# Altium schematic sheet Digital Isolation.SchDoc
size A3; SheetNumber: 7; SheetTotal: 9
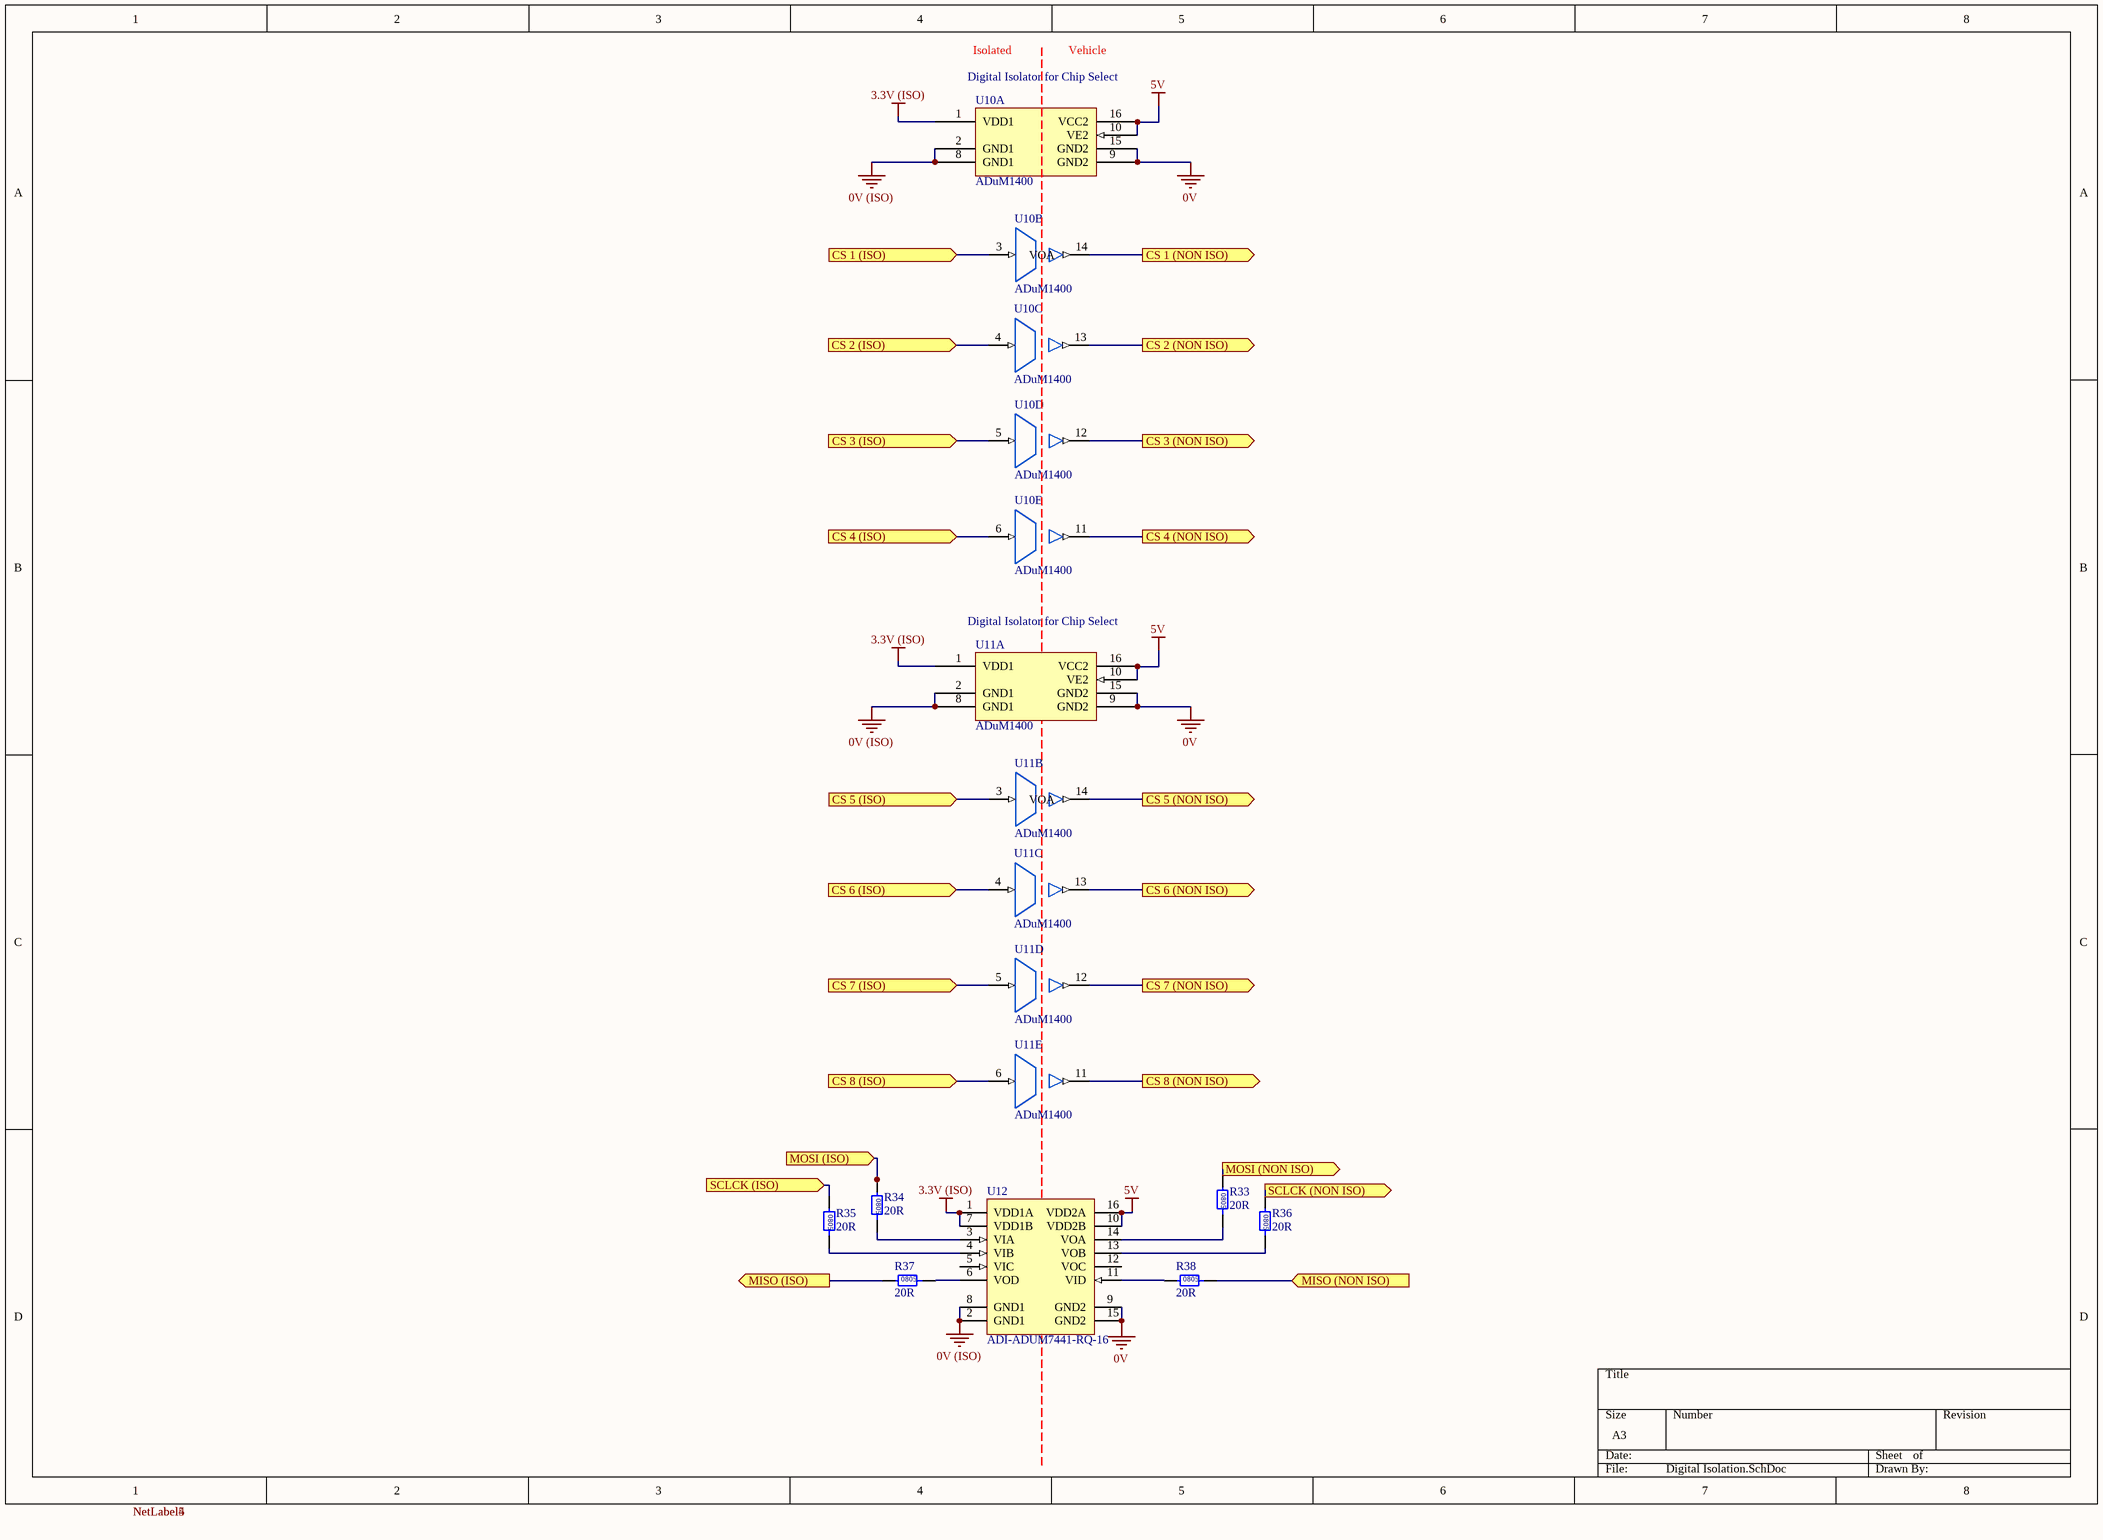
[diagram p0: Digital Isolation.SchDoc]

## Parts
R33  20R  [0805]
R34  20R  [0805]
R35  20R  [0805]
R36  20R  [0805]
R37  20R  [0805]
R38  20R  [0805]
U10  ADuM1400  [AD 16-SOIC]  (parts A,B,C,D,E of 5)
U11  ADuM1400  [AD 16-SOIC]  (parts A,B,C,D,E of 5)
U12  ADI-ADUM7441-RQ-16  [ADI-RQ-16_M]

## Ports
CS 1 (ISO) (in), CS 1 (NON ISO) (out), CS 2 (ISO) (in), CS 2 (NON ISO) (out), CS 3 (ISO) (in), CS 3 (NON ISO) (out), CS 4 (ISO) (in), CS 4 (NON ISO) (out), CS 5 (ISO) (in), CS 5 (NON ISO) (out), CS 6 (ISO) (in), CS 6 (NON ISO) (out), CS 7 (ISO) (in), CS 7 (NON ISO) (out), CS 8 (ISO) (in), CS 8 (NON ISO) (out), MISO (ISO) (out), MISO (NON ISO) (in), MOSI (ISO) (in), MOSI (NON ISO) (out), SCLCK (ISO) (in), SCLCK (NON ISO) (out)

## Nets
0V: U10.9(GND2) U10.15(GND2) U11.9(GND2) U11.15(GND2) U12.9(GND2) U12.15(GND2)
0V (ISO): U10.2(GND1) U10.8(GND1) U11.2(GND1) U11.8(GND1) U12.2(GND1) U12.8(GND1)
3.3V (ISO): U10.1(VDD1) U11.1(VDD1) U12.1(VDD1A) U12.7(VDD1B)
5V: U10.10(VE2) U10.16(VCC2) U11.10(VE2) U11.16(VCC2) U12.10(VDD2B) U12.16(VDD2A)
CS 1 (ISO): U10.3(VIA) ; port CS 1 (ISO)
CS 1 (NON ISO): U10.14(VOA) ; port CS 1 (NON ISO)
CS 2 (ISO): U10.4(VIB) ; port CS 2 (ISO)
CS 2 (NON ISO): U10.13(VOB) ; port CS 2 (NON ISO)
CS 3 (ISO): U10.5(VIC) ; port CS 3 (ISO)
CS 3 (NON ISO): U10.12(VOC) ; port CS 3 (NON ISO)
CS 4 (ISO): U10.6(VID) ; port CS 4 (ISO)
CS 4 (NON ISO): U10.11(VOD) ; port CS 4 (NON ISO)
CS 5 (ISO): U11.3(VIA) ; port CS 5 (ISO)
CS 5 (NON ISO): U11.14(VOA) ; port CS 5 (NON ISO)
CS 6 (ISO): U11.4(VIB) ; port CS 6 (ISO)
CS 6 (NON ISO): U11.13(VOB) ; port CS 6 (NON ISO)
CS 7 (ISO): U11.5(VIC) ; port CS 7 (ISO)
CS 7 (NON ISO): U11.12(VOC) ; port CS 7 (NON ISO)
CS 8 (ISO): U11.6(VID) ; port CS 8 (ISO)
CS 8 (NON ISO): U11.11(VOD) ; port CS 8 (NON ISO)
MISO (ISO): R37.1 ; port MISO (ISO)
MISO (NON ISO): R38.2 ; port MISO (NON ISO)
MOSI (ISO): R34.1 ; port MOSI (ISO)
MOSI (NON ISO): R33.1 ; port MOSI (NON ISO)
SCLCK (ISO): R35.1 ; port SCLCK (ISO)
SCLCK (NON ISO): R36.1 ; port SCLCK (NON ISO)
NetR33_2: R33.2 U12.14(VOA)
NetR34_2: R34.2 U12.3(VIA)
NetR35_2: R35.2 U12.4(VIB)
NetR36_2: R36.2 U12.13(VOB)
NetR37_2: R37.2 U12.6(VOD)
NetR38_1: R38.1 U12.11(VID)

Not connected (* = marked no-connect by the designer): U12 5(VIC) 12(VOC)

## Notes on the sheet
- (near U10) Digital Isolator for Chip Select
- Isolated
- Vehicle
- (near U11) Digital Isolator for Chip Select
- (in symbol RC0805FR0720RL) 0805

## Library data of the parts
R33-R38 = RC0805FR0720RL: Manufacturer: YAGEO; Tolerance: 0.01; Rated Power: 0.125W; Part Number: RC0805FR0720RL; Value: 20R; Material: FR-07; Digikey Part Number: 311-20.0CRCT-ND
U10 U11 = ADuM1400: General Purpose Digital Isolator 2500Vrms 4 Channel 1Mbps 25kV/µs CMTI 16-SOIC (0.295", 7.50mm Width); Manufacturer: Analog Devices; Part Number: ADuM1400; Digikey Part Number: ADUM1400WSRWZ-ND; Digikey Link: https://www.digikey.com/product-detail/en/analog-devices-inc/ADUM1400WSRWZ/ADUM1400WSRWZ-ND/1873713
U12 = ADUM7441ARQZ-RL7: DGTL ISO 1000VRMS 4CH GP 16QSOP; Manufacturer: Analog Devices; Part Number: ADUM7441ARQZ-RL7; Digikey Part Number: ADUM7441ARQZ-RL7TR-ND; Digikey Link: https://www.digikey.com.au/en/products/detail/analog-devices-inc/ADUM7441ARQZ-RL7/2261109?s=N4IgTCBcDaIIIBECqBZA7AFgwRjgJQEUAtAWjwBk0QBdAXyA